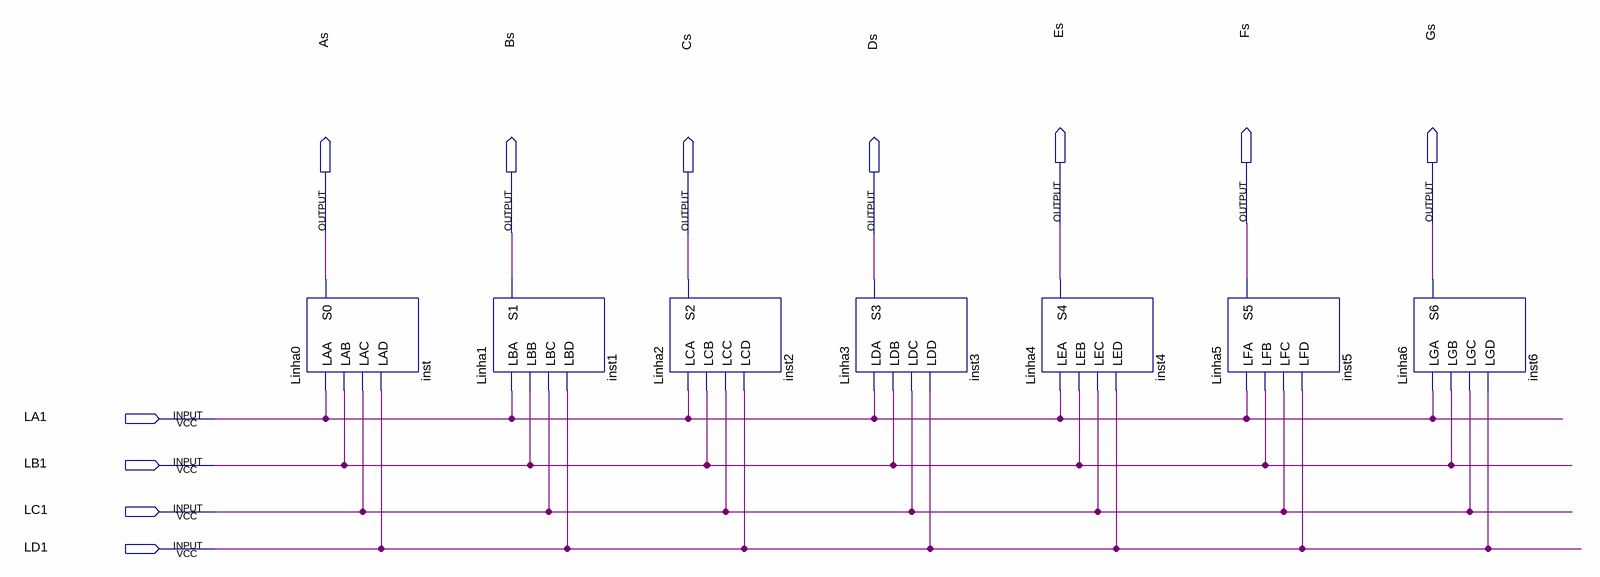
[diagram p0: schematic sheet]
// Quartus schematic DemultiplexadorLinha.bdf as structural Verilog: 7 symbols, 11 pins
module DemultiplexadorLinha (
  input  LA1,
  input  LB1,
  input  LC1,
  input  LD1,
  output Es,
  output Fs,
  output Gs,
  output As,
  output Bs,
  output Cs,
  output Ds
);

  Linha0 inst (.LAA(LA1), .LAB(LB1), .LAC(LC1), .LAD(LD1), .S0(As));
  Linha1 inst1 (.LBA(LA1), .LBB(LB1), .LBC(LC1), .LBD(LD1), .S1(Bs));
  Linha2 inst2 (.LCA(LA1), .LCB(LB1), .LCC(LC1), .LCD(LD1), .S2(Cs));
  Linha3 inst3 (.LDA(LA1), .LDB(LB1), .LDC(LC1), .LDD(LD1), .S3(Ds));
  Linha4 inst4 (.LEA(LA1), .LEB(LB1), .LEC(LC1), .LED(LD1), .S4(Es));
  Linha5 inst5 (.LFA(LA1), .LFB(LB1), .LFC(LC1), .LFD(LD1), .S5(Fs));
  Linha6 inst6 (.LGA(LA1), .LGB(LB1), .LGC(LC1), .LGD(LD1), .S6(Gs));
endmodule
